# EAGLE design PrototypeVar2(IcChanged) (EAGLE 7.4.0)
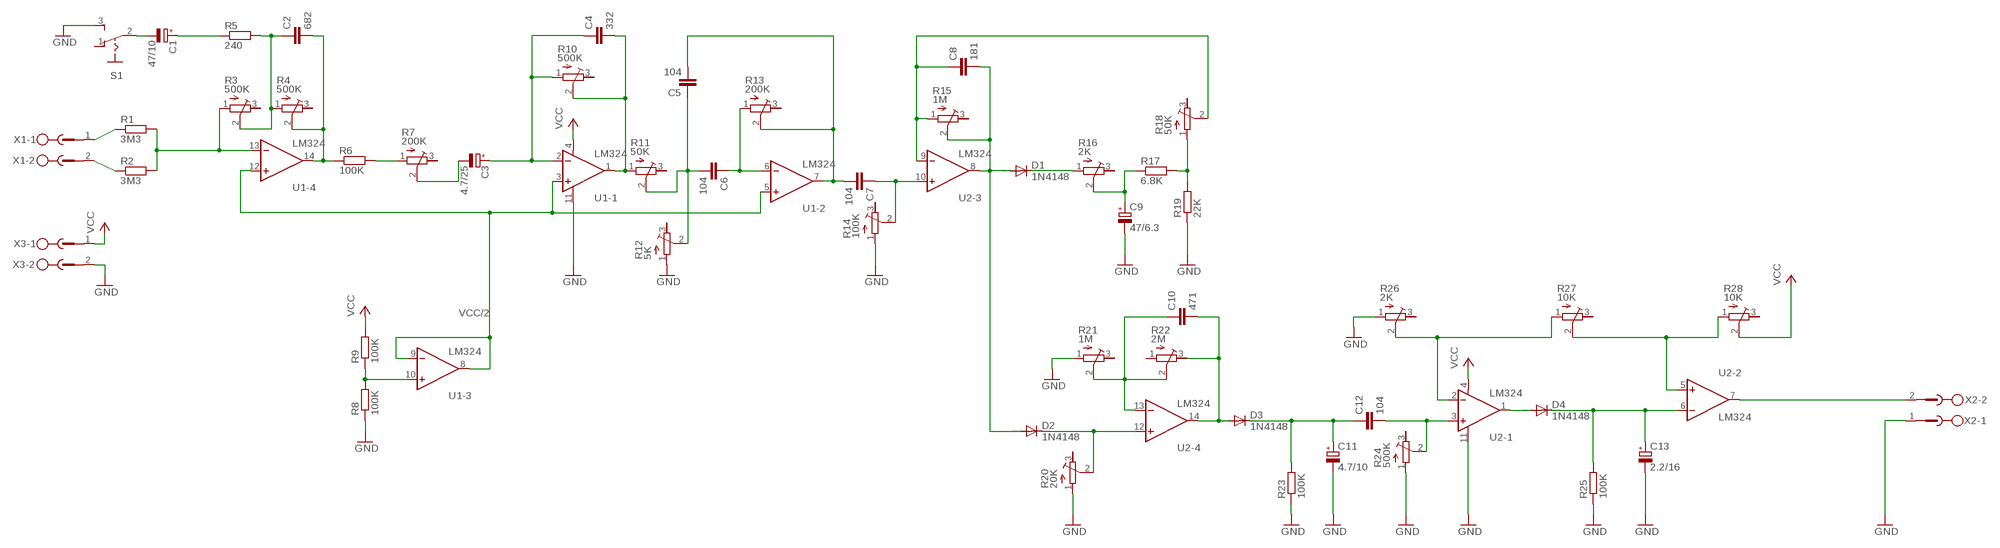
[diagram p0: schematic, sheet 1]

## Parts
C1  47/10  CPOL-EUE2.5-7  [E2,5-7]
C2  682  C-EU050-035X075  [C050-035X075]
C3  4.7/25  CPOL-EUE2.5-7  [E2,5-7]
C4  332  C-EU050-035X075  [C050-035X075]
C5  104  C-EU050-035X075  [C050-035X075]
C6  104  C-EU050-035X075  [C050-035X075]
C7  104  C-EU050-035X075  [C050-035X075]
C8  181  C-EU050-035X075  [C050-035X075]
C9  47/6.3  CPOL-EUE2.5-7  [E2,5-7]
C10  471  C-EU050-035X075  [C050-035X075]
C11  4.7/10  CPOL-EUE2.5-7  [E2,5-7]
C12  104  C-EU050-035X075  [C050-035X075]
C13  2.2/16  CPOL-EUE2.5-7  [E2,5-7]
D1  1N4148  1N4148DO35-10  [DO35-10]
D2  1N4148  1N4148DO35-10  [DO35-10]
D3  1N4148  1N4148DO35-10  [DO35-10]
D4  1N4148  1N4148DO35-10  [DO35-10]
R1  3M3  R-EU_0204/7  [0204/7]
R2  3M3  R-EU_0204/7  [0204/7]
R3  500K  R-TRIMM64W  [RTRIM64W]
R4  500K  R-TRIMM64W  [RTRIM64W]
R5  240  R-EU_0204/7  [0204/7]
R6  100K  R-EU_0204/7  [0204/7]
R7  200K  R-TRIMM64W  [RTRIM64W]
R8  100K  R-EU_0207/10  [0207/10]
R9  100K  R-EU_0207/10  [0207/10]
R10  500K  R-TRIMM64W  [RTRIM64W]
R11  50K  R-TRIMM64W  [RTRIM64W]
R12  5K  R-TRIMM64W  [RTRIM64W]
R13  200K  R-TRIMM64W  [RTRIM64W]
R14  100K  R-TRIMM64W  [RTRIM64W]
R15  1M  R-TRIMM64W  [RTRIM64W]
R16  2K  R-TRIMM64W  [RTRIM64W]
R17  6.8K  R-EU_0204/7  [0204/7]
R18  50K  R-TRIMM64W  [RTRIM64W]
R19  22K  R-EU_0204/7  [0204/7]
R20  20K  R-TRIMM64W  [RTRIM64W]
R21  1M  R-TRIMM64W  [RTRIM64W]
R22  2M  R-TRIMM64W  [RTRIM64W]
R23  100K  R-EU_0204/7  [0204/7]
R24  500K  R-TRIMM64W  [RTRIM64W]
R25  100K  R-EU_0204/7  [0204/7]
R26  2K  R-TRIMM64W  [RTRIM64W]
R27  10K  R-TRIMM64W  [RTRIM64W]
R28  10K  R-TRIMM64W  [RTRIM64W]
S1  255SB  [255SB]
U1-  LM324  [SOIC-14]
U2-  LM324  [SOIC-14]
X1  MSTBV2  [MSTBV2]
X2  MSTBV2  [MSTBV2]
X3  MSTBV2  [MSTBV2]

## Nets
GND: C9.- C11.- C13.- R8.1 R12.1(A) R14.1(A) R19.1 R20.1(A) R21.1(A) R23.1 R24.1(A) R25.1 R26.1(A) S1.3(S) U1-.11(1:V-) U2-.11(1:V-) X2.1 X3.2
N$1: C3.+ C4.1 R10.1(A) U1-.2(1:-IN)
N$2: C4.2 R10.2(S) R11.1(A) U1-.1(1:OUT)
N$3: C5.1 C6.2 R11.2(S) R12.2(S)
N$4: C5.2 C7.2 R13.2(S) U1-.7(2:OUT)
N$5: C7.1 R14.2(S) U2-.10(3:+IN)
N$6: C6.1 R13.1(A) U1-.6(2:-IN)
N$7: C8.1 R15.1(A) R18.2(S) U2-.9(3:-IN)
N$8: D1.C R16.1(A)
N$9: C1.+ R5.1
N$10: C9.+ R16.2(S) R17.1
N$11: C2.2 R4.2(S) R6.1 U1-.14(4:OUT)
N$12: D2.C R20.2(S) U2-.12(4:+IN)
N$13: C10.1 R21.2(S) R22.2(S) U2-.13(4:-IN)
N$14: C2.1 R3.2(S) R4.1(A) R5.2
N$15: C10.2 D3.A R22.3(E) U2-.14(4:OUT)
N$16: C11.+ C12.1 D3.C R23.2
N$17: C12.2 R24.2(S) U2-.3(1:+IN)
N$18: D4.A U2-.1(1:OUT)
N$19: C13.+ D4.C R25.2 U2-.6(2:-IN)
N$20: R26.2(S) R27.1(A) U2-.2(1:-IN)
N$21: R27.2(S) R28.1(A) U2-.5(2:+IN)
N$22: R1.1 X1.1
N$23: R17.2 R18.1(A) R19.2
N$24: R8.2 R9.1 U1-.10(3:+IN)
N$25: R6.2 R7.1(A)
N$26: C3.- R7.2(S)
N$27: U2-.7(2:OUT) X2.2
N$29: C1.- S1.2(P)
N$30: R1.2 R2.2 R3.1(A) U1-.13(4:-IN)
N$31: R2.1 X1.2
U2-: C8.2 D1.A D2.A R15.2(S) U2-.8(3:OUT)
VCC: R9.2 R28.2(S) U1-.4(1:V+) U2-.4(1:V+) X3.1
VCC/2: U1-.3(1:+IN) U1-.5(2:+IN) U1-.8(3:OUT) U1-.9(3:-IN) U1-.12(4:+IN)
Unconnected: R3.3(E) R4.3(E) R7.3(E) R10.3(E) R11.3(E) R12.3(E) R13.3(E) R14.3(E) R15.3(E) R16.3(E) R18.3(E) R20.3(E) R21.3(E) R22.1(A) R24.3(E) R26.3(E) R27.3(E) R28.3(E) S1.1(O)

## Library data of the parts
C1 C3 C9 C11 C13 = resistor:CPOL-EU: POLARIZED CAPACITOR, European symbol
C2 C4-C8 C10 C12 = resistor:C-EU: CAPACITOR, European symbol
D1-D4 = diode:1N4148: DIODE high speed (Philips)
R1 R2 R5 R6 R8 R9 R17 R19 R23 R25 = resistor:R-EU_: RESISTOR, European symbol
R3 R4 R7 R10-R16 R18 R20-R22 R24 R26-R28 = resistor:R-TRIMM: Trimm resistor
S1 = switch:255SB: SLIDING SWITCH Distributor Buerklin, 11G810
U1- U2- = seanvoisen:LM324: LM324 Quad Op-amp
X1-X3 = con-phoenix-500:MSTBV2: PHOENIX; OC_FARNELL: unknown; OC_NEWARK: unknown

## Board
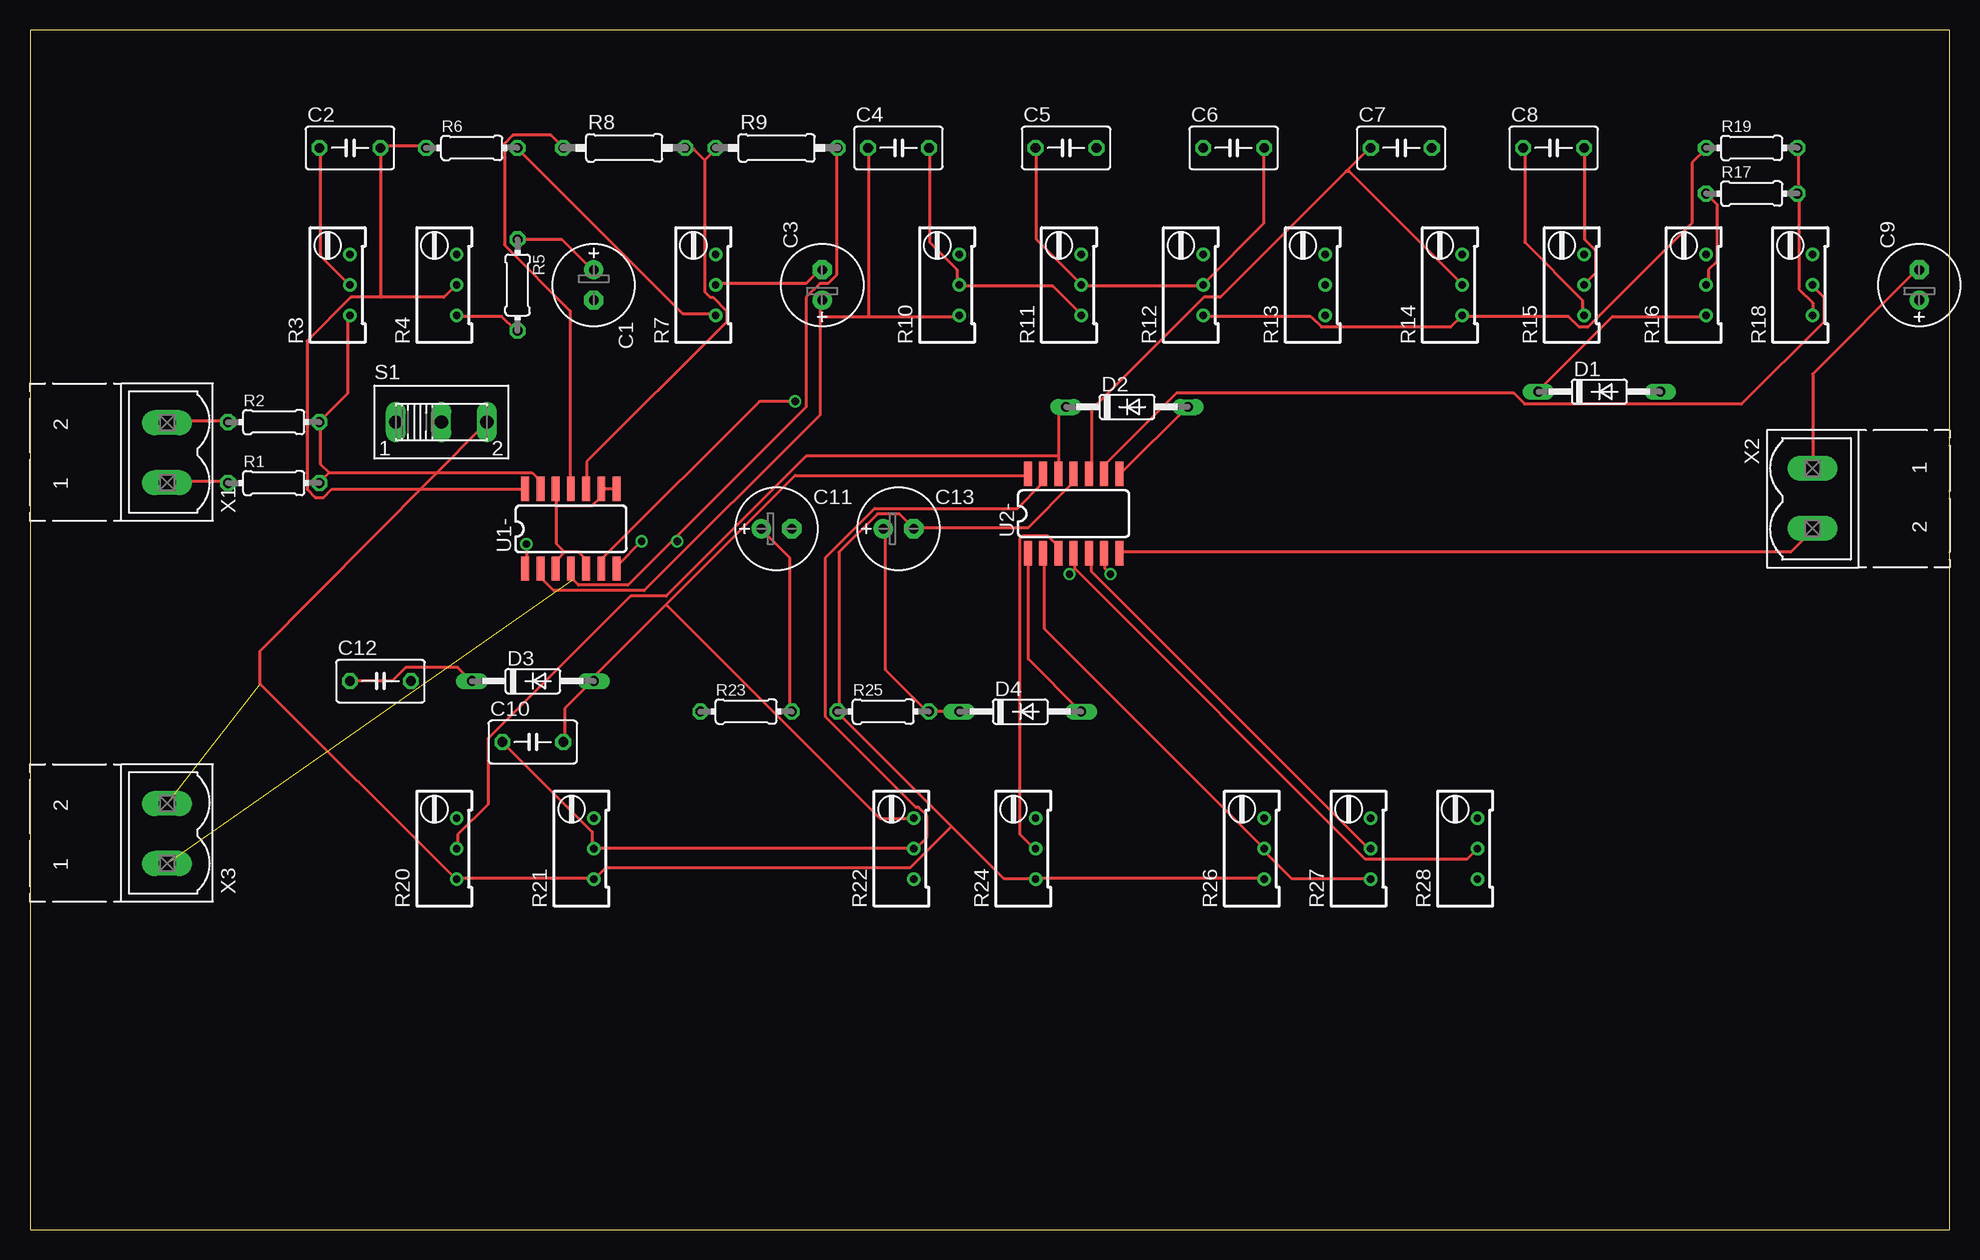
[diagram p1: board, top side]
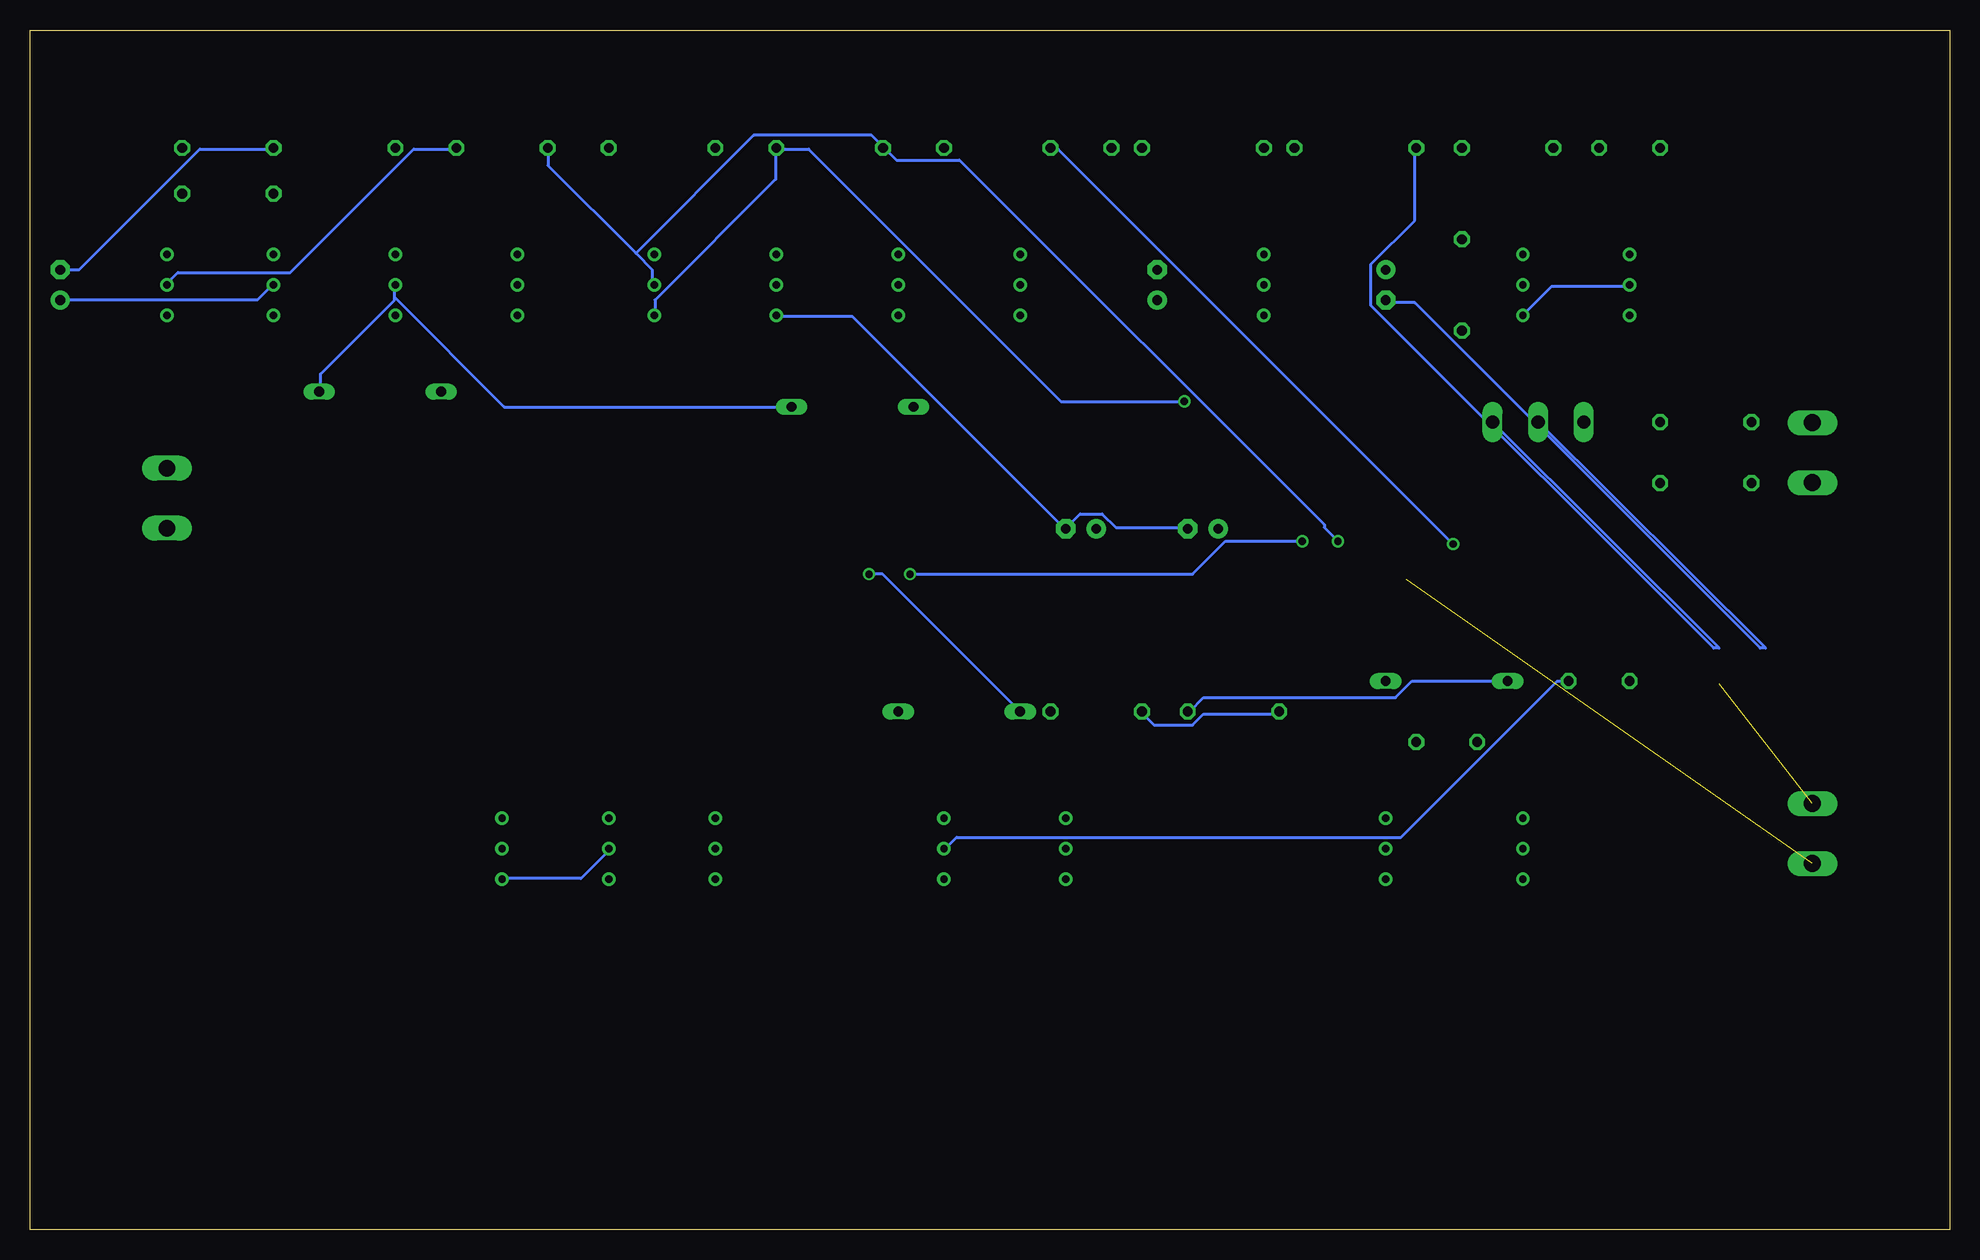
[diagram p2: board, bottom side, seen from below]

Size 160 x 100 mm. Coordinates in mm from the lower left corner, seen from the top.
Outline: 0,0 160,0 160,100 0,100 0,0
Copper layers (1*16): Top 0.035mm / dielectric 1.5mm / Bottom 0.035mm
Design rules "default": minimum track width 10mil, minimum drill 24mil, track to track 8mil, track to pad 8mil, pad to pad 8mil, via to via 8mil, smd to smd 8mil, copper to edge 40mil, drill to drill 8mil, minimum pad ring 10mil, minimum via ring 8mil, stop-mask expansion 4mil, vias tented up to drill 0mil, thermal gap 10mil

### Footprints (pad centres in the part's own frame; a part is rotated, then mirrored left to right if it is on the bottom)
E2,5-7 = drill 0.813 pad 1.6: + -1.27,0 | drill 0.813 pad 1.6 octagon: - 1.27,0
C050-035X075 = drill 0.813 octagon: 1 -2.54,0; 2 2.54,0
DO35-10 = drill 0.813 long: A 5.08,0; C -5.08,0
0204/7 = drill 0.813 octagon: 1 -3.81,0; 2 3.81,0
RTRIM64W = drill 0.61: 1 1.27,-2.54; 2 1.27,0; 3 1.27,2.54
0207/10 = drill 0.813 octagon: 1 -5.08,0; 2 5.08,0
255SB = drill 1.118 long: 1 -3.81,0; 2 0,0; 3 3.81,0
SOIC-14 = smd 0.66 x 2.032: 1 -4.445,-3.315; 2 -3.175,-3.315; 3 -1.905,-3.315; 4 -0.635,-3.315; 5 0.635,-3.315; 6 1.905,-3.315; 7 3.175,-3.315; 8 3.175,3.315; 9 1.905,3.315; 10 0.635,3.315; 11 -0.635,3.315; 12 -1.905,3.315; 13 -3.175,3.315; 14 -4.445,3.315
MSTBV2 = drill 1.397 long: 1 -2.5,0; 2 2.5,0

### Placement (x,y rotation side)
C1  46.99,78.74 270 top
C2  26.67,90.17 0 top
C3  66.04,78.74 90 top
C4  72.39,90.17 0 top
C5  86.36,90.17 0 top
C6  100.33,90.17 0 top
C7  114.3,90.17 0 top
C8  127,90.17 0 top
C9  157.48,78.74 90 top
C10  41.91,40.64 0 top
C11  62.23,58.42 0 top
C12  29.21,45.72 0 top
C13  72.39,58.42 0 top
D1  130.81,69.85 0 top
D2  91.44,68.58 0 top
D3  41.91,45.72 0 top
D4  82.55,43.18 0 top
R1  20.32,62.23 0 top
R2  20.32,67.31 0 top
R3  25.4,78.74 0 top
R4  34.29,78.74 0 top
R5  40.64,78.74 270 top
R6  36.83,90.17 0 top
R7  55.88,78.74 0 top
R8  49.53,90.17 0 top
R9  62.23,90.17 0 top
R10  76.2,78.74 0 top
R11  86.36,78.74 0 top
R12  96.52,78.74 0 top
R13  106.68,78.74 0 top
R14  118.11,78.74 0 top
R15  128.27,78.74 0 top
R16  138.43,78.74 0 top
R17  143.51,86.36 0 top
R18  147.32,78.74 0 top
R19  143.51,90.17 0 top
R20  34.29,31.75 0 top
R21  45.72,31.75 0 top
R22  72.39,31.75 0 top
R23  59.69,43.18 0 top
R24  82.55,31.75 0 top
R25  71.12,43.18 0 top
R26  101.6,31.75 0 top
R27  110.49,31.75 0 top
R28  119.38,31.75 0 top
S1  34.29,67.31 0 top
U1-  45.72,58.42 0 top
U2-  87.63,59.69 0 top
X1  11.43,64.77 90 top
X2  148.59,60.96 270 top
X3  11.43,33.02 90 top

### Tracks (layer width: path | path; a pad name or v marks a point on that pad's centre or on a via)
GND  (1 unrouted)
  Top 0.254: R12.1 97.84,76.12 106.76,76.12 107.67,75.21 118.42,75.21 119.33,76.12 R14.1 119.56,76.12 128.25,76.12 129.16,75.21 129.84,75.21 138.53,83.9 138.53,88.92 139.68,90.07 R19.1 | X2.1 148.59,71.32 157.28,80.01 C9.- | R26.1 102.87,29.26 83.9,29.26 R24.1 83.67,29.26 81.15,29.26 76.81,33.6 | U2-.11 86.87,62.87 86.87,62.18 83.21,58.52 73.84,58.52 C13.- 73.61,58.52 72.47,59.66 70.64,59.66 67.44,56.46 67.44,43.2 R25.1 67.44,42.98 76.81,33.6 | U1-.11 45.03,61.95 45.03,76.58 39.55,82.07 39.55,90.53 40.23,91.21 43.43,91.21 44.35,90.3 R8.1 | S1.3 19.2,48.23 19.2,45.49 35.43,29.26 R20.1 35.66,29.26 46.86,29.26 R21.1 47.09,29.26 48.01,30.18 73.38,30.18 76.81,33.6
  Bottom 0.254: C9.- 155.91,80.01 145.85,90.07 139.9,90.07 R19.1 | R23.1 56.01,42.98 62.18,42.98 63.09,42.06 66.29,42.06 67.21,42.98 R25.1 | C11.- 63.55,58.52 69.49,58.52 70.64,59.66 72.47,59.66 73.61,58.52 C13.- 73.84,58.52 91.44,76.12 97.61,76.12 R12.1 | R8.1 44.58,90.07 44.58,84.12 48.23,80.47 48.23,77.04 19.66,48.46 19.2,48.46 S1.3
N$1
  Top 0.254: 65.84,76.12 65.84,77.27 C3.+ | 65.84,76.12 65.84,67.89 51.21,53.26 43.66,53.26 42.75,54.18 42.75,55.09 U1-.2 | 65.84,76.12 69.95,76.12 | 69.95,76.12 77.27,76.12 R10.1 | 69.95,76.12 69.95,90.07 C4.1
N$2  (via drill 0.61)
  Top 0.254: R11.1 87.55,76.35 85.27,78.64 77.5,78.64 R10.2 77.27,78.87 77.27,80.01 74.98,82.3 74.98,90.07 C4.2 | v41.38,57.15 41.38,55.32 U1-.1
  Bottom 0.254: v41.38,57.15 74.3,90.07 74.75,90.07 C4.2
N$3
  Top 0.254: C5.1 83.9,90.07 83.9,82.53 87.55,78.87 R11.2 87.78,78.64 97.61,78.64 R12.2 97.84,78.87 102.87,83.9 C6.2
N$4  (via drill 0.61)
  Top 0.254: v50.98,57.38 48.92,55.32 U1-.7
  Bottom 0.254: 109.5,81.38 116.81,88.7 116.81,90.07 C7.2 | 109.5,81.38 108.13,80.01 108.13,78.87 R13.2 | v50.98,57.38 52.12,58.52 52.12,58.75 82.53,89.15 87.78,89.15 88.7,90.07 C5.2 88.92,90.3 89.84,91.21 99.67,91.21 109.5,81.38
N$5
  Top 0.254: 109.73,88.24 111.56,90.07 C7.1 | 109.73,88.24 99.21,77.72 97.84,77.72 88.47,68.35 88.47,63.09 U2-.10 | 109.73,88.24 109.96,88.24 119.33,78.87 R14.2
N$6  (via drill 0.61)
  Top 0.254: v63.78,69.04 60.81,69.04 47.78,56.01 47.78,55.32 U1-.6
  Bottom 0.254: v63.78,69.04 74.07,69.04 95.1,90.07 97.61,90.07 C6.1 97.84,90.07 97.84,87.55 107.9,77.5 107.9,76.35 R13.1
N$7
  Top 0.254: R15.1 129.39,76.35 129.39,77.5 124.59,82.3 124.59,90.07 C8.1 | U2-.9 89.61,63.09 89.61,63.78 95.56,69.72 123.67,69.72 124.59,68.81 142.65,68.81 149.5,75.67 149.5,77.72 148.59,78.64 R18.2
  Bottom 0.254: C8.1 124.59,90.07 128.02,90.07 138.3,79.78 147.68,79.78 148.59,78.87 R18.2
N$8
  Top 0.254: R16.1 139.68,76.12 131.9,76.12 125.73,69.95 D1.C
N$9
  Top 0.254: R5.1 40.69,82.53 44.35,82.53 46.86,80.01 C1.+
N$10
  Top 0.254: R16.2 139.9,78.87 139.9,80.01 140.59,80.7 140.59,85.5 139.9,86.18 R17.1
  Bottom 0.254: C9.+ 157.28,77.5 141.05,77.5 139.9,78.64 R16.2
N$11
  Top 0.254: R6.1 32.92,90.3 29.26,90.3 C2.2 29.26,90.07 29.26,77.72 | 29.26,77.72 34.52,77.72 35.43,78.64 R4.2 | 29.26,77.72 26.75,77.72 23.09,74.07 23.09,61.72 23.77,61.04 24.46,61.04 25.15,61.72 41.15,61.72 U1-.14
N$12
  Top 0.254: 85.72,64.47 85.72,68.12 86.18,68.58 D2.C | 85.72,64.47 U2-.12 | 85.72,64.47 64.69,64.47 53.03,52.81 50.06,52.81 38.18,40.92 38.18,35.43 35.66,32.92 35.66,31.77 R20.2
N$13
  Top 0.254: C10.1 46.86,33.15 46.86,31.77 R21.2 47.09,31.77 73.61,31.77 R22.2 73.84,31.77 74.75,32.69 74.75,34.52 74.07,35.2 73.84,35.2 66.29,42.75 66.29,56.01 70.41,60.12 82.3,60.12 84.35,62.18 84.35,62.87 U2-.13
N$14
  Top 0.254: R4.1 35.66,76.12 39.32,76.12 40.46,74.98 R5.2 | C2.1 24.23,90.07 24.23,81.15 26.52,78.87 R3.2
  Bottom 0.254: R3.2 26.75,78.64 33.15,78.64 35.43,76.35 R4.1
N$15
  Top 0.254: 53.03,52.12 47.09,46.18 47.09,45.72 D3.A 46.86,45.72 44.58,43.43 44.58,40.69 C10.2 | 53.03,52.12 63.78,62.87 82.98,62.87 U2-.14 | R22.3 70.87,34.29 53.03,52.12
N$16
  Top 0.254: C12.1 30.18,45.72 31.32,46.86 35.66,46.86 36.8,45.72 D3.C | R23.2 63.32,43.2 63.32,56.01 61.04,58.29 C11.+
  Bottom 0.254: D3.C 44.81,45.72 46.18,44.35 62.18,44.35 63.32,43.2 R23.2
N$17
  Top 0.254: U2-.3 85.72,56.92 84.81,57.84 82.75,57.84 82.53,57.61 82.53,32.92 83.67,31.77 R24.2
  Bottom 0.254: C12.2 32.69,45.72 45.72,32.69 82.75,32.69 83.67,31.77 R24.2
N$18
  Top 0.254: U2-.1 83.21,56.24 83.21,47.55 87.55,43.2 D4.A
N$19  (via drill 0.61)
  Top 0.254: v90.07,54.63 89.61,55.09 89.61,56.24 U2-.6 | D4.C 77.27,43.2 74.98,43.2 R25.2 74.75,43.2 71.32,46.63 71.32,58.29 C13.+
  Bottom 0.254: v90.07,54.63 88.92,54.63 D4.C
N$20
  Top 0.254: U2-.2 84.58,56.24 84.58,50.06 102.87,31.77 R26.2 102.87,31.55 105.16,29.26 111.56,29.26 R27.1
N$21
  Top 0.254: U2-.5 88.47,56.24 88.47,54.86 111.56,31.77 R27.2
  Bottom 0.254: R28.1 120.47,29.26 114.07,29.26 111.78,31.55 R27.2
N$22
  Top 0.254: R1.1 16.46,62.41 11.43,62.41 X1.1
N$23
  Top 0.254: R18.1 148.59,77.27 147.45,78.41 147.45,86.18 R17.2 147.45,86.41 147.45,90.07 R19.2
N$24
  Top 0.254: 56.24,89.15 56.24,78.18 56.69,77.72 56.92,77.72 58.06,76.58 58.06,75.67 46.41,64.01 46.41,61.95 U1-.10 | 56.24,89.15 57.15,90.07 R9.1 | 56.24,89.15 55.32,90.07 54.63,90.07 R8.2
N$25
  Top 0.254: R7.1 57.15,76.35 54.41,76.35 40.69,90.07 R6.2
N$26
  Top 0.254: R7.2 57.15,78.87 64.69,78.87 65.84,80.01 C3.-
N$27
  Top 0.254: U2-.7 90.98,56.46 146.76,56.46 148.59,58.29 X2.2
N$29
  Bottom 0.254: C1.- 46.86,77.27 44.58,77.27 15.77,48.46 15.32,48.46 S1.2
N$30
  Top 0.254: R3.1 26.52,76.12 26.52,69.72 24.23,67.44 R2.2 24.23,67.21 24.23,63.78 24.92,63.09 | 24.92,63.09 41.83,63.09 42.52,62.41 42.52,61.95 U1-.13 | 24.92,63.09 24.23,62.41 R1.2
N$31
  Top 0.254: R2.1 16.46,67.44 11.43,67.44 X1.2
U2-
  Top 0.254: U2-.8 90.98,63.09 96.47,68.58 D2.A | C8.2 129.62,90.07 129.62,82.53 130.53,81.61 130.53,79.78 129.62,78.87 R15.2
  Bottom 0.254: 129.62,77.72 129.62,77.5 135.79,71.32 135.79,69.95 D1.A | 129.62,77.72 129.62,78.64 R15.2 | D2.A 120.47,68.58 129.62,77.72
VCC  (via drill 0.61)  (1 unrouted)
  Top 0.254: 53.72,57.61 64.69,68.58 64.69,77.72 65.84,78.87 66.52,78.87 67.21,79.55 67.21,90.07 R9.2 | 53.72,57.61 49.84,53.72 45.72,53.72 45.26,54.18 45.26,55.09 U1-.4 | 87.1,55.09 87.1,56.24 U2-.4 | 87.1,55.09 111.33,30.86 119.79,30.86 120.47,31.55 R28.2 | v53.95,57.38 53.72,57.61 | 87.1,55.09 v86.64,54.63
  Bottom 0.254: v53.95,57.38 60.35,57.38 63.09,54.63 v86.64,54.63
VCC/2
  Top 0.254: U1-.8 48.69,61.72 47.78,61.72 U1-.9 47.55,61.72 47.55,61.04 46.86,60.35 43.89,60.35 | 44.58,56.46 43.89,55.78 43.89,55.32 U1-.3 | 44.58,56.46 45.72,56.46 46.18,56.01 46.18,55.32 U1-.5 | 43.89,60.35 43.89,57.15 44.58,56.46 | 43.89,60.35 43.89,61.72 U1-.12